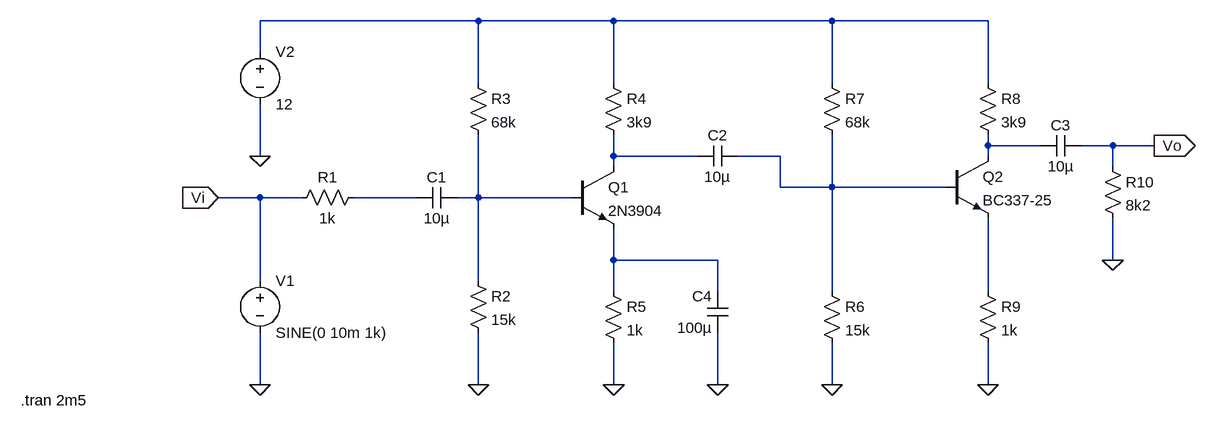
[diagram p0: schematic esquematico.asc]
esquematico.asc, the LTspice schematic file:
Version 4.1
SHEET 1 1496 680
WIRE 368 -320 32 -320
WIRE 576 -320 368 -320
WIRE 912 -320 576 -320
WIRE 1152 -320 912 -320
WIRE 32 -272 32 -320
WIRE 368 -224 368 -320
WIRE 576 -224 576 -320
WIRE 912 -224 912 -320
WIRE 1152 -224 1152 -320
WIRE 1152 -128 1152 -144
WIRE 1232 -128 1152 -128
WIRE 1344 -128 1296 -128
WIRE 1408 -128 1344 -128
WIRE 32 -112 32 -192
WIRE 576 -112 576 -144
WIRE 704 -112 576 -112
WIRE 832 -112 768 -112
WIRE 1152 -112 1152 -128
WIRE 576 -96 576 -112
WIRE 1344 -96 1344 -128
WIRE 832 -64 832 -112
WIRE 912 -64 912 -144
WIRE 912 -64 832 -64
WIRE 1088 -64 912 -64
WIRE 32 -48 -32 -48
WIRE 96 -48 32 -48
WIRE 272 -48 176 -48
WIRE 368 -48 368 -144
WIRE 368 -48 336 -48
WIRE 512 -48 368 -48
WIRE 576 48 576 0
WIRE 736 48 576 48
WIRE 1344 48 1344 -16
WIRE 32 80 32 -48
WIRE 368 80 368 -48
WIRE 576 96 576 48
WIRE 736 96 736 48
WIRE 912 96 912 -64
WIRE 1152 96 1152 -16
WIRE 32 240 32 160
WIRE 368 240 368 160
WIRE 576 240 576 176
WIRE 736 240 736 160
WIRE 912 240 912 176
WIRE 1152 240 1152 176
FLAG 32 240 0
FLAG 368 240 0
FLAG 576 240 0
FLAG 736 240 0
FLAG 912 240 0
FLAG 1152 240 0
FLAG 1344 48 0
FLAG 32 -112 0
FLAG 1408 -128 Vo
IOPIN 1408 -128 Out
FLAG -32 -48 Vi
IOPIN -32 -48 In
SYMBOL voltage 32 64 R0
WINDOW 123 0 0 Left 0
WINDOW 39 0 0 Left 0
SYMATTR InstName V1
SYMATTR Value SINE(0 10m 1k)
SYMBOL res 192 -64 R90
WINDOW 0 0 56 VBottom 2
WINDOW 3 32 56 VTop 2
SYMATTR InstName R1
SYMATTR Value 1k
SYMBOL cap 336 -64 R90
WINDOW 0 0 32 VBottom 2
WINDOW 3 32 32 VTop 2
SYMATTR InstName C1
SYMATTR Value 10µ
SYMBOL res 352 64 R0
SYMATTR InstName R2
SYMATTR Value 15k
SYMBOL res 352 -240 R0
SYMATTR InstName R3
SYMATTR Value 68k
SYMBOL res 560 -240 R0
SYMATTR InstName R4
SYMATTR Value 3k9
SYMBOL npn 512 -96 R0
SYMATTR InstName Q1
SYMATTR Value 2N3904
SYMBOL res 560 80 R0
SYMATTR InstName R5
SYMATTR Value 1k
SYMBOL res 896 80 R0
SYMATTR InstName R6
SYMATTR Value 15k
SYMBOL res 896 -240 R0
SYMATTR InstName R7
SYMATTR Value 68k
SYMBOL res 1136 -240 R0
SYMATTR InstName R8
SYMATTR Value 3k9
SYMBOL res 1136 80 R0
SYMATTR InstName R9
SYMATTR Value 1k
SYMBOL res 1328 -112 R0
SYMATTR InstName R10
SYMATTR Value 8k2
SYMBOL cap 768 -128 R90
WINDOW 0 0 32 VBottom 2
WINDOW 3 32 32 VTop 2
SYMATTR InstName C2
SYMATTR Value 10µ
SYMBOL cap 1296 -144 R90
WINDOW 0 0 32 VBottom 2
WINDOW 3 32 32 VTop 2
SYMATTR InstName C3
SYMATTR Value 10µ
SYMBOL cap 752 160 R180
WINDOW 0 24 56 Left 2
WINDOW 3 24 8 Left 2
SYMATTR InstName C4
SYMATTR Value 100µ
SYMBOL npn 1088 -112 R0
SYMATTR InstName Q2
SYMATTR Value BC337-25
SYMBOL voltage 32 -288 R0
WINDOW 123 0 0 Left 0
WINDOW 39 0 0 Left 0
SYMATTR InstName V2
SYMATTR Value 12
TEXT -336 264 Left 2 !.tran 2m5

The netlist it stands for:
* esquematico.asc
V1 Vi 0 SINE(0 10m 1k)
R1 N005 Vi 1k
C1 N006 N005 10µ
R2 N006 0 15k
R3 N001 N006 68k
R4 N001 N003 3k9
Q1 N003 N006 N007 0 2N3904
R5 N007 0 1k
R6 N004 0 15k
R7 N001 N004 68k
R8 N001 N002 3k9
R9 N008 0 1k
R10 Vo 0 8k2
C2 N004 N003 10µ
C3 Vo N002 10µ
C4 0 N007 100µ
Q2 N002 N004 N008 0 BC337-25
V2 N001 0 12
.model NPN NPN
.model PNP PNP
.lib standard.bjt
.tran 2m5
.backanno
.end